# Altium project CTA2045.PrjPcb
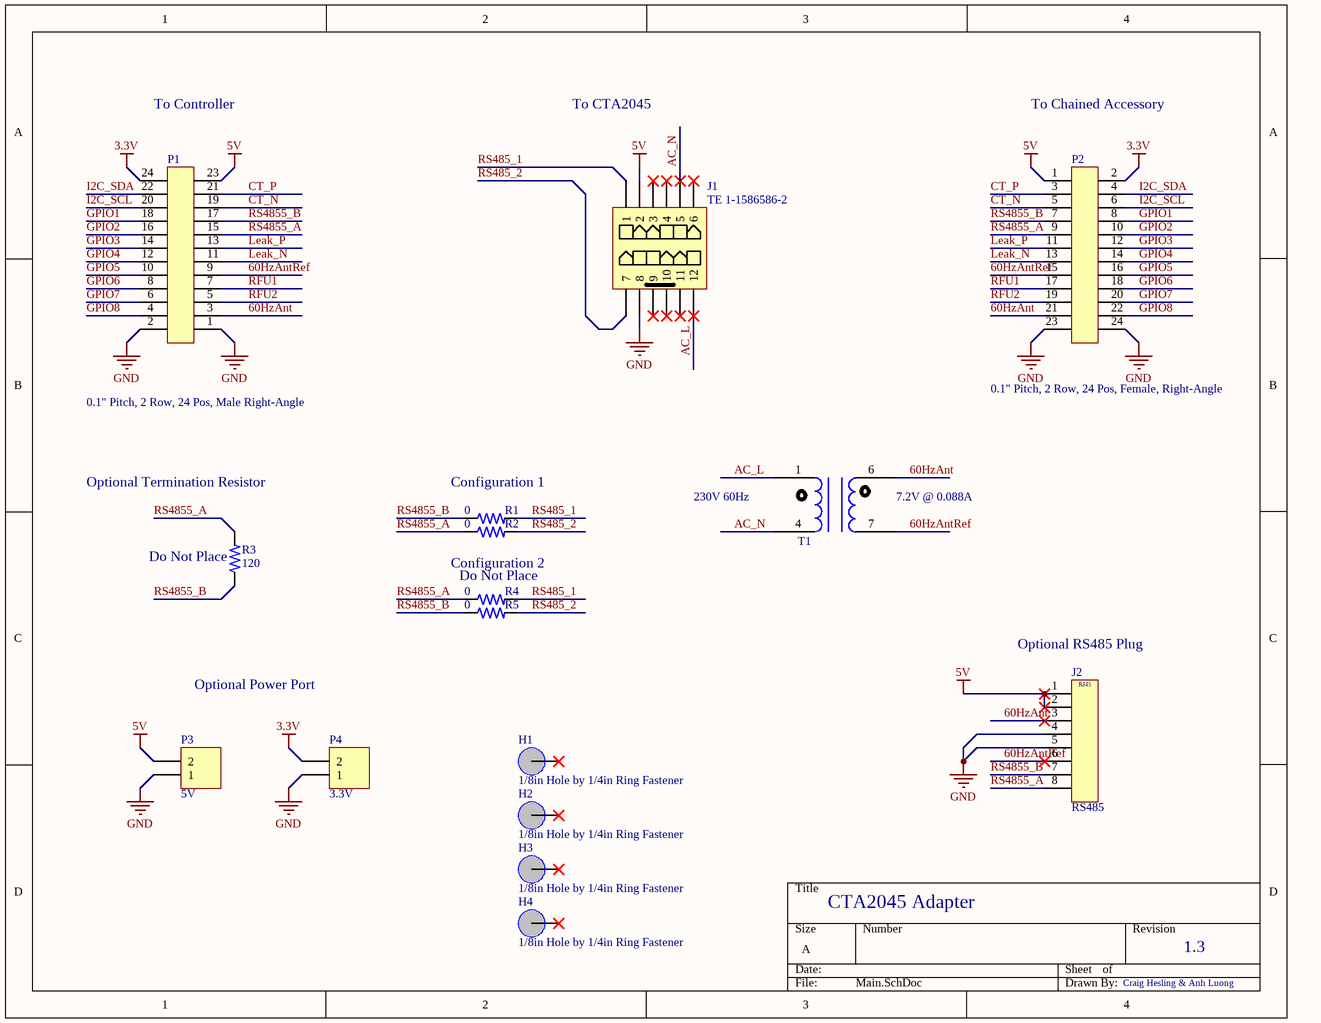
[diagram p0: Main.SchDoc]
1 sheet, 16 parts. Net scope: global (net labels, ports and power ports of the same name join across sheets).
Board files: CTA2045v1.PcbDoc, CTA2045v1.1.PcbDoc, CTA2045v1.2.PcbDoc, CTA2045v1.3.PcbDoc

## Sheet Main.SchDoc: CTA2045 Adapter
size A; Author: Craig Hesling & Anh Luong; DrawnBy: Craig Hesling & Anh Luong; Revision: 1.3

### Parts
H1  1/8in Hole by 1/4in Ring Fastener  [1/8in Fastener Hole]
H2  1/8in Hole by 1/4in Ring Fastener  [1/8in Fastener Hole]
H3  1/8in Hole by 1/4in Ring Fastener  [1/8in Fastener Hole]
H4  1/8in Hole by 1/4in Ring Fastener  [1/8in Fastener Hole]
J1  TE 1-1586586-2  [12POS 4.2mm Pitch Vertical]
J2  RS485  [RJ45 Unshielded PTH Connector]
P1  0.1" Pitch, 2 Row, 24 Pos, Male Right-Angle  [0.1 inch 2 row 24 pos male right-angle header Sullins]
P2  0.1" Pitch, 2 Row, 24 Pos, Female, Right-Angle  [0.1 inch 2 row 24 pos female right-angle header Sullins]
P3  5V  [HDR1X2]
P4  3.3V  [HDR1X2]
R1  0  [RESC1608X06L - RES0603]
R2  0  [RESC1608X06L - RES0603]
R3  120  [RESC1608X06L - RES0603]
R4  0  [RESC1608X06L - RES0603]
R5  0  [RESC1608X06L - RES0603]
T1  SPK00304  [SPK003]  (value not drawn)

### Nets
3.3V: P1.24 P2.2 P4.2
5V: J1.2 J2.1 J2.2 P1.23 P2.1 P3.2
GND: J1.8 J2.4 J2.5 P1.1 P1.2 P2.23 P2.24 P3.1 P4.1
60HzAnt: J2.3 P1.3 P2.21 T1.6
60HzAntRef: J2.6 P1.9 P2.15 T1.7
AC_L: J1.12 T1.1
AC_N: J1.5 T1.4
CT_N: P1.19 P2.5
CT_P: P1.21 P2.3
GPIO1: P1.18 P2.8
GPIO2: P1.16 P2.10
GPIO3: P1.14 P2.12
GPIO4: P1.12 P2.14
GPIO5: P1.10 P2.16
GPIO6: P1.8 P2.18
GPIO7: P1.6 P2.20
GPIO8: P1.4 P2.22
I2C_SCL: P1.20 P2.6
I2C_SDA: P1.22 P2.4
Leak_N: P1.11 P2.13
Leak_P: P1.13 P2.11
RFU1: P1.7 P2.17
RFU2: P1.5 P2.19
RS485_1: J1.1 R1.2 R4.2
RS485_2: J1.7 R2.2 R5.2
RS4855_A: J2.8 P1.15 P2.9 R2.1 R3.2 R4.1
RS4855_B: J2.7 P1.17 P2.7 R1.1 R3.1 R5.1

Not connected (* = marked no-connect by the designer): H1 1*; H2 1*; H3 1*; H4 1*; J1 3* 4* 6* 9* 10* 11*

### Notes on the sheet
- To Controller
- To CTA2045
- To Chained Accessory
- Optional Termination Resistor
- Configuration 1
- 230V 60Hz
- (near T1) 7.2V @ 0.088A
- (near R3) Do Not Place
- Configuration 2
- (near R4) Do Not Place
- Optional Power Port
- (near J2) Optional RS485 Plug

### Library data of the parts
H1-H4 = 1/8in by 1/4in Fastner Hole
J1 = 12POS 4.2mm Pitch Vertical: TE Connectivity 1-1586586-2; Supplier 1: Allied; Supplier 2: Digi-Key; Supplier Part Number 1: 70041598; Supplier Part Number 2: 1-1586586-2-ND
J2 = RJ45 Unshielded PTH Connector: Amphenol RJ45 Unshielded Through-Hole Connector; Manufacturer: Amphenol FCI; Manufacturer Part Number: 54601-908WPLF; Contact Resistance: 30mR; Current Rating: 1A; Voltage Rating: 1kV; Number of Positions: 8; Number of Ports: 1; Insulation Resistance: 500MR; Direction: Down; Gender: Male; Pitch: 2.54mm; Supplier 1: Digi-Key; Supplier Part Number 1: 609-5081-ND; Supplier 2: Mouser; Stock 2: 0; Pricing 2: 1=0.51, 10=0.377, 50=0.377, 100=0.362, 1000=0.26, 10000=0.212 (USD); Mount: Through Hole; Contact Plating: Nickel,Gold; Contact Material: Bronze,Copper; Colour: Black; Housing Colour: Black; Housing Material: Polyamide; Min Operating Temperature: -65°C; Max Operating Temperature: 125°C; Termination: Through Hole; Orientation: Right Angle; Packaging: Rail/Tube; Shielding: Unshielded; Package Quantity: 200; Number of Rows: 1; Connector Type: RJ45; Number of Contacts: 8; Number of Positions Loaded: 8; Length: 15.24mm; Depth: 18mm; Radiation Hardening: No; REACH SVHC: No SVHC; Lead Free: Lead Free; Flammability Rating: UL94 V-0; ComponentLink1URL: https://datasheet.ciiva.com/9396/c-bmj-0051-9396388.pdf; ComponentLink1Description: https://datasheet.ciiva.com/9396/c-bmj-0051-9396388.pdf; ComponentLink2URL: https://datasheet.ciiva.com/26824/getdatasheetpartid-465238-26824373.pdf; ComponentLink2Description: https://datasheet.ciiva.com/26824/getdatasheetpartid-465238-26824373.pdf; ComponentLink3URL: https://datasheet.ciiva.com/1108/c-bmj-0051-1108424.pdf; ComponentLink3Description: https://datasheet.ciiva.com/1108/c-bmj-0051-1108424.pdf; ComponentLink4URL: https://datasheet.ciiva.com/15058/c-bmj-0051-15058750.pdf; ComponentLink4Description: https://datasheet.ciiva.com/15058/c-bmj-0051-15058750.pdf; ComponentLink5URL: https://datasheet.ciiva.com/16650/c-bmj-0051-16650286.pdf; ComponentLink5Description: https://datasheet.ciiva.com/16650/c-bmj-0051-16650286.pdf; ComponentLink6URL: https://datasheet.ciiva.com/7629/c-bmj-0051-7629183.pdf; ComponentLink6Description: https://datasheet.ciiva.com/7629/c-bmj-0051-7629183.pdf; Supplier Part Number 2: 649-54601-908WPLF
P1 = 0.1" 2 row 24 position male right-angle header sullins: Sullins 0.1" 2 row 24 position male right-angle header; Rows: 2; Positions: 24; Pitch: 2.54mm; Gender: Male; Supplier 1: Digi-Key; Supplier Part Number 1: S2112EC-12-ND
P2 = 0.1" 2 row 24 position female right-angle header sullins: Sullins 0.1" 2 row 24 position female right-angle header; Rows: 2; Positions: 24; Pitch: 2.54mm; Supplier 1: Digi-Key; Supplier 2: Digi-Key; Supplier Part Number 1: S5526-ND; Supplier Part Number 2: S5565-ND
P3 P4 = Header 2: Header, 2-Pin; LatestRevisionDate: 17-Jul-2002; LatestRevisionNote: Re-released for DXP Platform.; Publisher: Altium Limited
R1 R2 R4 R5 = RES0603 0 Jumper 1/10W: SMT 0603 Ceramic Resistor; Power: 1/10W; Tolerance: Jumper; Value: 0; Supplier 1: Digi-Key; Supplier 2: Digi-Key; Supplier Part Number 1: 311-0.0GRCT-ND; Supplier Part Number 2: P0.0GCT-ND
R3 = RES0603 120 1% 1/10W: SMT 0603 Ceramic Resistor; Value: 120; Supplier 1: Digi-Key; Supplier 2: Digi-Key; Supplier 3: Digi-Key; Supplier Part Number 1: 311-120HRCT-ND; Supplier Part Number 2: RMCF0603FT120RCT-ND; Supplier Part Number 3: YAG3563CT-ND
T1 = SPK00304: Standard PCB-Transformers | SPK-003 | POWER 0.35 VA